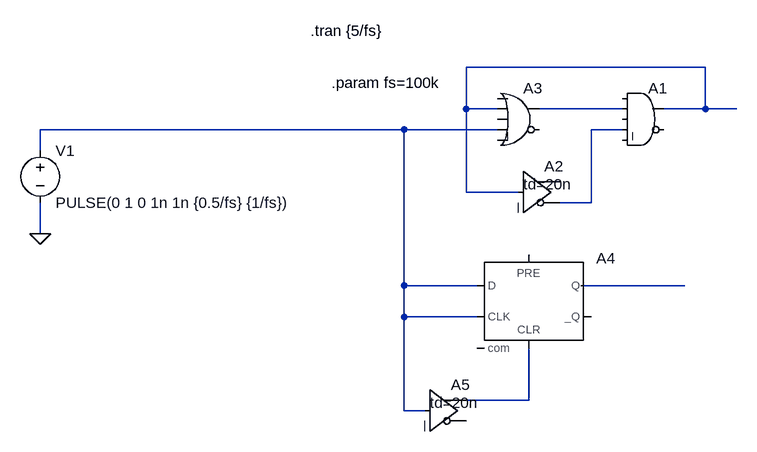
[diagram p0: schematic Draft1.asc]
Draft1.asc, the LTspice schematic file:
Version 4.1
SHEET 1 880 680
WIRE 288 48 -80 48
WIRE -80 112 -80 48
WIRE -32 112 -80 112
WIRE 160 112 32 112
WIRE 288 112 288 48
WIRE 288 112 224 112
WIRE 336 112 288 112
WIRE -176 144 -736 144
WIRE -32 144 -176 144
WIRE 160 144 112 144
WIRE -736 176 -736 144
WIRE -80 240 -80 112
WIRE 0 240 -80 240
WIRE 112 256 112 144
WIRE 112 256 64 256
WIRE -736 304 -736 256
WIRE -176 384 -176 144
WIRE -64 384 -176 384
WIRE 256 384 96 384
WIRE -176 432 -176 384
WIRE -64 432 -176 432
WIRE 16 560 16 480
WIRE 16 560 -80 560
WIRE -176 576 -176 432
WIRE -144 576 -176 576
FLAG -736 304 0
SYMBOL Digital\\and 192 64 R0
SYMATTR InstName A1
SYMBOL Digital\\buf 0 176 R0
WINDOW 123 8 52 Left 2
SYMATTR InstName A2
SYMATTR Value2 td=20n
SYMBOL Digital\\or 0 64 R0
SYMATTR InstName A3
SYMBOL voltage -736 160 R0
WINDOW 123 0 0 Left 0
WINDOW 39 0 0 Left 0
SYMATTR InstName V1
SYMATTR Value PULSE(0 1 0 1n 1n {0.5/fs} {1/fs})
SYMBOL Digital\\dflop 16 336 R0
SYMATTR InstName A4
SYMBOL Digital\\buf -144 512 R0
WINDOW 123 8 52 Left 2
SYMATTR InstName A5
SYMATTR Value2 td=20n
TEXT -320 -8 Left 2 !.tran {5/fs}
TEXT -288 72 Left 2 !.param fs=100k

The netlist it stands for:
* Draft1.asc
A1 0 N002 0 N004 0 0 N001 0 AND
A2 N001 0 0 0 0 N004 0 0 BUF td=20n
A3 0 N001 0 N003 0 0 N002 0 OR
V1 N003 0 PULSE(0 1 0 1n 1n {0.5/fs} {1/fs})
A4 N003 0 N003 0 N006 0 N005 0 DFLOP
A5 N003 0 0 0 0 0 N006 0 BUF td=20n
.tran {5/fs}
.param fs=100k
.backanno
.end